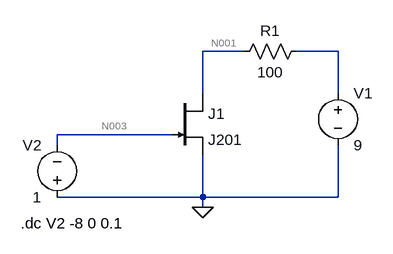
[diagram p0: schematic j201.asc]
j201.asc, the LTspice schematic file:
Version 4
SHEET 1 880 680
WIRE 240 32 176 32
WIRE 384 32 320 32
WIRE 176 96 176 32
WIRE 384 96 384 32
WIRE 128 160 -48 160
WIRE -48 176 -48 160
WIRE 176 256 176 192
WIRE 176 256 -48 256
WIRE 384 256 384 176
WIRE 384 256 176 256
WIRE 176 272 176 256
FLAG 176 272 0
SYMBOL njf 128 96 R0
SYMATTR InstName J1
SYMATTR Value J201
SYMBOL voltage 384 80 R0
WINDOW 123 0 0 Left 0
WINDOW 39 0 0 Left 0
SYMATTR InstName V1
SYMATTR Value 9
SYMBOL voltage -48 272 R180
WINDOW 0 24 96 Left 2
WINDOW 3 24 16 Left 2
WINDOW 123 0 0 Left 0
WINDOW 39 0 0 Left 0
SYMATTR InstName V2
SYMATTR Value 1
SYMBOL res 336 16 R90
WINDOW 0 0 56 VBottom 2
WINDOW 3 32 56 VTop 2
SYMATTR InstName R1
SYMATTR Value 100
TEXT -104 296 Left 2 !.dc V2 -8 0 0.1

The netlist it stands for:
* j201.asc
J1 N001 N003 0 J201
V1 N002 0 9
V2 0 N003 1
R1 N002 N001 100
.model NJF NJF
.model PJF PJF
.lib standard.jft
.dc V2 -8 0 0.1
.backanno
.end

* Results of the author's LTspice run, read from the files saved beside the schematic
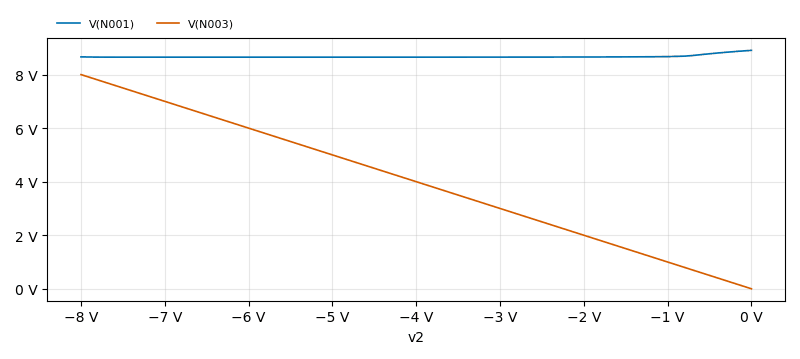
[diagram p1: DC transfer characteristic of j201.asc, plotted from the saved traces]
* DC transfer characteristic, 1 run:
*   V(N001): 8.661 V at v2=-8 V, 8.904 V at v2=0 V, min 8.65 V, max 8.904 V
*   V(N003): 8 V at v2=-8 V, 0 V at v2=0 V, min 0 V, max 8 V